# EAGLE board PCB3 (EAGLE 9.6.2)
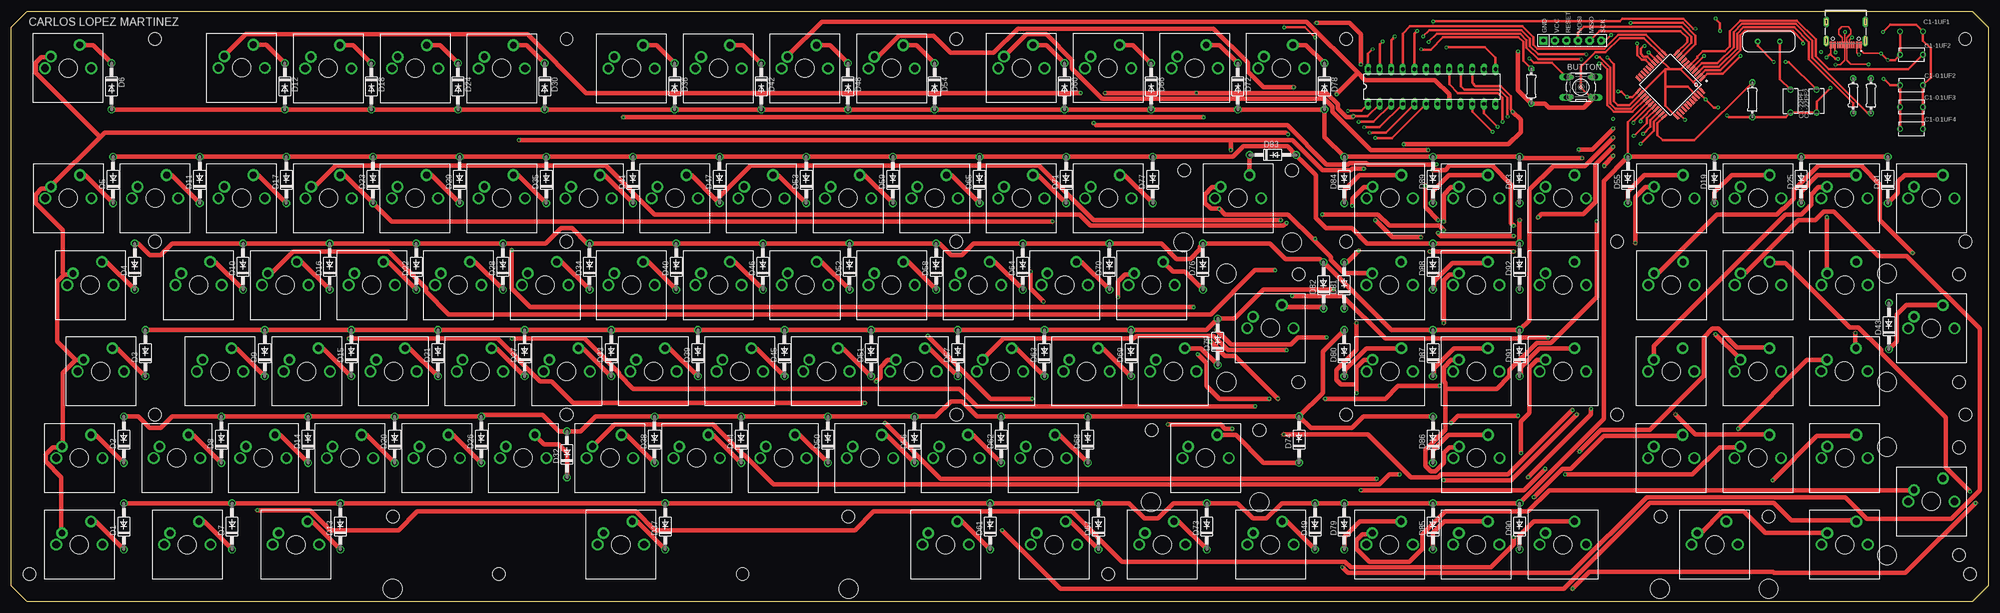
[diagram p2: board, top side]
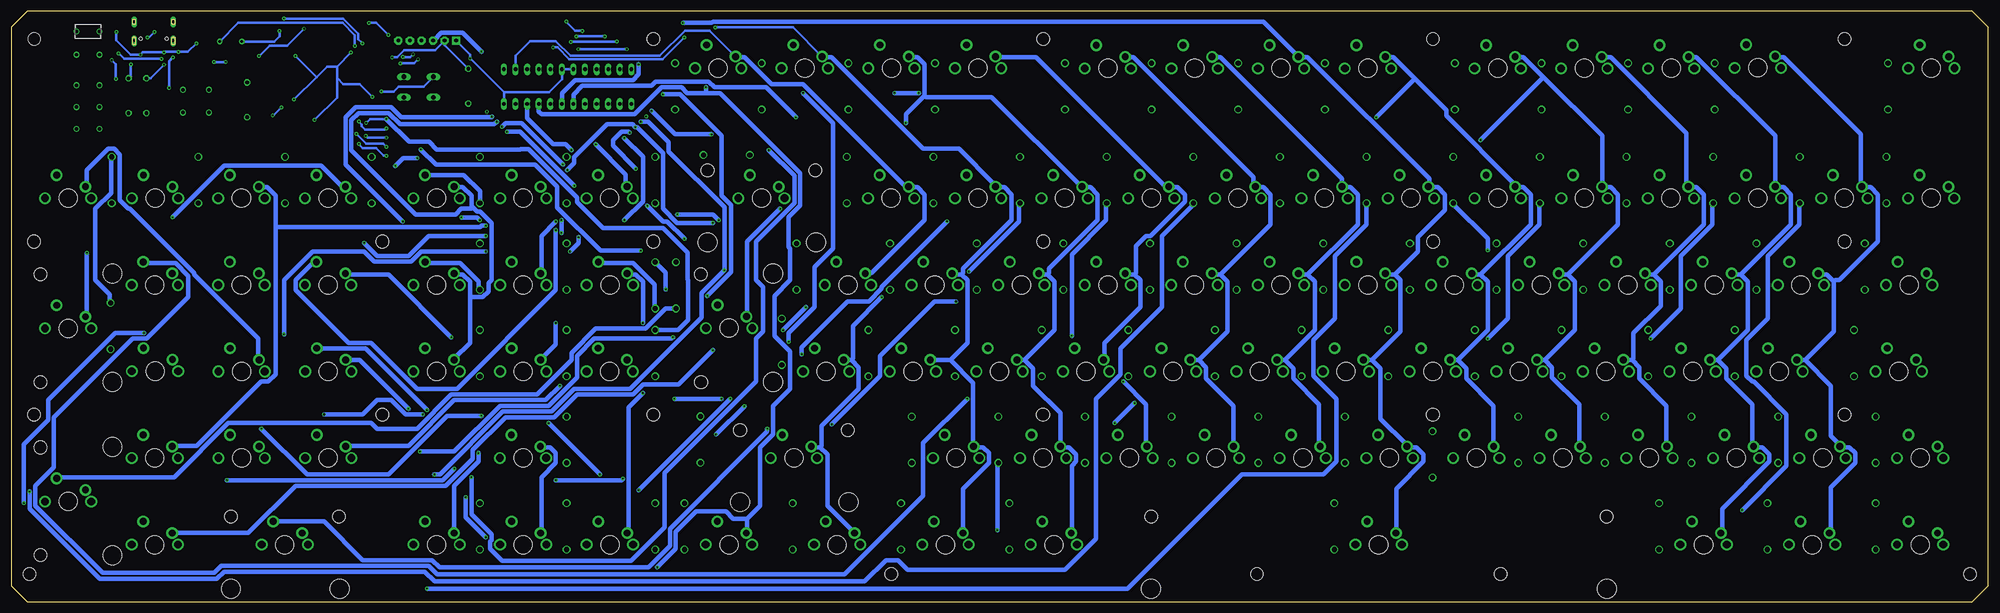
[diagram p3: board, bottom side, seen from below]

Size 433.5 x 129.5 mm. Coordinates in mm from the lower left corner, seen from the top.
Outline: 0,126 3.5,129.5 430,129.5 433.5,126 433.5,3.5 430,0 3.5,0 0,3.5 0,126
Copper layers (1*16): Top 0.035mm / dielectric 1.5mm / Bottom 0.035mm
Design rules "default *": minimum track width 0.5mm, minimum drill 0.35mm, track to track 10mil, track to pad 10mil, pad to pad 7mil, via to via 10mil, smd to smd 7mil, copper to edge 40mil, drill to drill 6mil, minimum pad ring 10mil, minimum via ring 8mil, stop-mask expansion 4mil, vias tented up to drill 0mil, thermal gap 10mil
Net classes: 0 default: width 0.203 mm
Holes 4.2 mm at 249.93,21.83 273.73,21.83 183.57,2.83 83.57,2.83 361.55,2.83 385.35,2.83 411.33,10.15 411.33,33.95 411.33,48.15 411.33,71.95 266.45,48.15 266.45,71.95 257.05,78.83 280.85,78.83
Holes 2.8 mm at 250.05,37.63 273.7,37.63 183.55,18.63 83.7,18.63 361.67,18.63 385.32,18.63 427.13,10.18 427.13,33.83 427.13,48.18 427.13,71.83 282.25,48.18 282.26,71.82 280.83,94.63 257.18,94.63 352.13,79 428.5,79 428.5,41 352.13,41 292.75,41 292.75,79 240.5,6.04 4,6.03 31.51,78.99 121.75,79 207.25,78.99 207.26,41 121.76,41 31.5,40.99 429.5,6.04
Holes 2.75 mm at 31.5,123.47 121.75,123.47 207.25,123.46 292.75,123.46 428.5,123.47 160.36,6.03 106.89,6.04

## Footprints (pad centres in the part's own frame; a part is rotated, then mirrored left to right if it is on the bottom)
B3F-10XX = drill 1.016 long: 1 -3.251,2.261; 2 3.251,2.261; 3 -3.251,-2.261; 4 3.251,-2.261
CAP_RDE5C1H273J2M1H03A = drill 0.75 pad 1.15: 1 -2.5,0; 2 2.5,0
DO41-10 = drill 1.118: A 5.08,0; C -5.08,0
CHERRY-MX = drill 1.714 pad 1.93: P$3 -5.08,0; P$4 5.08,0 | drill 1.5 pad 2.54: SW1 -3.81,2.54; SW2 2.54,5.08 | hole 4: 0,0
HRO_TYPE-C-31-M-12 = smd 0.6 x 1.45: A1B12 -3.25,5.095; A4B9 -2.45,5.095; B1A12 3.25,5.095; B4A9 2.45,5.095 | smd 0.3 x 1.45: A5 -1.25,5.095; A6 -0.25,5.095; A7 0.25,5.095; A8 1.25,5.095; B5 1.75,5.095; B6 0.75,5.095; B7 -0.75,5.095; B8 -1.75,5.095 | drill 0.65 pad 1.05 long: S1 -4.32,4.18; S2 4.32,4.18; S3 -4.32,0; S4 4.32,0 | hole 0.7: -2.89,3.65; 2.89,3.65
SIP-100-06-32 = drill 0.813 pad 1.778 square: 1 -6.35,0 | drill 0.813 pad 1.778 octagon: 2 -3.81,0; 3 -1.27,0; 4 1.27,0; 5 3.81,0; 6 6.35,0
DIL24-3 = drill 0.813 long: 1 -13.97,-3.81; 2 -11.43,-3.81; 3 -8.89,-3.81; 4 -6.35,-3.81; 5 -3.81,-3.81; 6 -1.27,-3.81; 7 1.27,-3.81; 8 3.81,-3.81; 9 6.35,-3.81; 10 8.89,-3.81; 11 11.43,-3.81; 12 13.97,-3.81; 13 13.97,3.81; 14 11.43,3.81; 15 8.89,3.81; 16 6.35,3.81; 17 3.81,3.81; 18 1.27,3.81; 19 -1.27,3.81; 20 -3.81,3.81; 21 -6.35,3.81; 22 -8.89,3.81; 23 -11.43,3.81; 24 -13.97,3.81
0204/7 = drill 0.813 octagon: 1 -3.81,0; 2 3.81,0
QFP80P1200X1200X120-44N = smd 1.5 x 0.5: 1 -5.9,4; 2 -5.9,3.2; 3 -5.9,2.4; 4 -5.9,1.6; 5 -5.9,0.8; 6 -5.9,0; 7 -5.9,-0.8; 8 -5.9,-1.6; 9 -5.9,-2.4; 10 -5.9,-3.2; 11 -5.9,-4; 23 5.9,-4; 24 5.9,-3.2; 25 5.9,-2.4; 26 5.9,-1.6; 27 5.9,-0.8; 28 5.9,0; 29 5.9,0.8; 30 5.9,1.6; 31 5.9,2.4; 32 5.9,3.2; 33 5.9,4 | smd 0.5 x 1.5: 12 -4,-5.9; 13 -3.2,-5.9; 14 -2.4,-5.9; 15 -1.6,-5.9; 16 -0.8,-5.9; 17 0,-5.9; 18 0.8,-5.9; 19 1.6,-5.9; 20 2.4,-5.9; 21 3.2,-5.9; 22 4,-5.9; 34 4,5.9; 35 3.2,5.9; 36 2.4,5.9; 37 1.6,5.9; 38 0.8,5.9; 39 0,5.9; 40 -0.8,5.9; 41 -1.6,5.9; 42 -2.4,5.9; 43 -3.2,5.9; 44 -4,5.9
XTAL_ECS-160-20-4X = drill 0.63 pad 1.03: 1 -2.44,0; 2 2.44,0

## Placement (x,y rotation side)
BUTTON  [B3F-10XX]  344.2,112.9 0 top
C1-0.1UF2  RDE5C1H273J2M1H03A  [CAP_RDE5C1H273J2M1H03A]  416.7,113.3 180 top
C1-0.1UF3  RDE5C1H273J2M1H03A  [CAP_RDE5C1H273J2M1H03A]  416.7,108.5 180 top
C1-0.1UF4  RDE5C1H273J2M1H03A  [CAP_RDE5C1H273J2M1H03A]  416.7,103.7 180 top
C1-1UF1  RDE5C1H273J2M1H03A  [CAP_RDE5C1H273J2M1H03A]  416.7,125.1 0 bottom
C1-1UF2  RDE5C1H273J2M1H03A  [CAP_RDE5C1H273J2M1H03A]  416.7,120 180 top
C1-22PF1  RDE5C1H273J2M1H03A  [CAP_RDE5C1H273J2M1H03A]  390.2,109.8 270 top
C1-22PF2  RDE5C1H273J2M1H03A  [CAP_RDE5C1H273J2M1H03A]  395.9,109.8 270 top
D1  1N4004  [DO41-10]  24.65,16.5 90 top
D2  1N4004  [DO41-10]  24.65,35.5 90 top
D3  1N4004  [DO41-10]  29.4,54.5 90 top
D4  1N4004  [DO41-10]  27.05,73.5 90 top
D5  1N4004  [DO41-10]  22.3,92.5 90 top
D6  1N4004  [DO41-10]  21.95,113.05 270 top
D7  1N4004  [DO41-10]  48.4,16.5 90 top
D8  1N4004  [DO41-10]  46.05,35.5 90 top
D9  1N4004  [DO41-10]  55.55,54.5 90 top
D10  1N4004  [DO41-10]  50.8,73.5 90 top
D11  1N4004  [DO41-10]  41.3,92.5 90 top
D12  1N4004  [DO41-10]  59.95,113.05 270 top
D13  1N4004  [DO41-10]  72.15,16.5 90 top
D14  1N4004  [DO41-10]  65.05,35.5 90 top
D15  1N4004  [DO41-10]  74.55,54.5 90 top
D16  1N4004  [DO41-10]  69.8,73.5 90 top
D17  1N4004  [DO41-10]  60.3,92.5 90 top
D18  1N4004  [DO41-10]  78.95,113.05 270 top
D19  1N4004  [DO41-10]  373.5,92.5 90 top
D20  1N4004  [DO41-10]  84.05,35.5 90 top
D21  1N4004  [DO41-10]  93.55,54.5 90 top
D22  1N4004  [DO41-10]  88.8,73.5 90 top
D23  1N4004  [DO41-10]  79.3,92.5 90 top
D24  1N4004  [DO41-10]  97.95,113.05 270 top
D25  1N4004  [DO41-10]  392.5,92.5 90 top
D26  1N4004  [DO41-10]  103.05,35.5 90 top
D27  1N4004  [DO41-10]  112.55,54.5 90 top
D28  1N4004  [DO41-10]  107.8,73.5 90 top
D29  1N4004  [DO41-10]  98.3,92.5 90 top
D30  1N4004  [DO41-10]  116.95,113.05 270 top
D31  1N4004  [DO41-10]  411.5,92.5 90 top
D32  1N4004  [DO41-10]  121.85,32.3 90 top
D33  1N4004  [DO41-10]  131.55,54.5 90 top
D34  1N4004  [DO41-10]  126.8,73.5 90 top
D35  1N4004  [DO41-10]  117.3,92.5 90 top
D36  1N4004  [DO41-10]  145.45,113.05 270 top
D37  1N4004  [DO41-10]  143.4,16.5 90 top
D38  1N4004  [DO41-10]  141.05,35.5 90 top
D39  1N4004  [DO41-10]  150.55,54.5 90 top
D40  1N4004  [DO41-10]  145.8,73.5 90 top
D41  1N4004  [DO41-10]  136.3,92.5 90 top
D42  1N4004  [DO41-10]  164.45,113.05 270 top
D43  1N4004  [DO41-10]  411.75,60.45 90 top
D44  1N4004  [DO41-10]  160.05,35.5 90 top
D45  1N4004  [DO41-10]  169.55,54.5 90 top
D46  1N4004  [DO41-10]  164.8,73.5 90 top
D47  1N4004  [DO41-10]  155.3,92.5 90 top
D48  1N4004  [DO41-10]  183.45,113.05 270 top
D49  1N4004  [DO41-10]  285.9,16.5 90 top
D50  1N4004  [DO41-10]  179.05,35.5 90 top
D51  1N4004  [DO41-10]  188.55,54.5 90 top
D52  1N4004  [DO41-10]  183.8,73.5 90 top
D53  1N4004  [DO41-10]  174.3,92.5 90 top
D54  1N4004  [DO41-10]  202.45,113.05 270 top
D55  1N4004  [DO41-10]  354.5,92.5 90 top
D56  1N4004  [DO41-10]  198.05,35.5 90 top
D57  1N4004  [DO41-10]  207.55,54.5 90 top
D58  1N4004  [DO41-10]  202.8,73.5 90 top
D59  1N4004  [DO41-10]  193.3,92.5 90 top
D60  1N4004  [DO41-10]  230.95,113.05 270 top
D61  1N4004  [DO41-10]  214.65,16.5 90 top
D62  1N4004  [DO41-10]  217.05,35.5 90 top
D63  1N4004  [DO41-10]  226.55,54.5 90 top
D64  1N4004  [DO41-10]  221.8,73.5 90 top
D65  1N4004  [DO41-10]  212.3,92.5 90 top
D66  1N4004  [DO41-10]  249.95,113.05 270 top
D67  1N4004  [DO41-10]  238.4,16.5 90 top
D68  1N4004  [DO41-10]  236.05,35.5 90 top
D69  1N4004  [DO41-10]  245.55,54.5 90 top
D70  1N4004  [DO41-10]  240.8,73.5 90 top
D71  1N4004  [DO41-10]  231.3,92.5 90 top
D72  1N4004  [DO41-10]  268.95,113.05 270 top
D73  1N4004  [DO41-10]  262.15,16.5 90 top
D74  1N4004  [DO41-10]  282.4,35.55 90 top
D75  1N4004  [DO41-10]  264.55,57 90 top
D76  1N4004  [DO41-10]  261.3,73.5 90 top
D77  1N4004  [DO41-10]  250.3,92.5 90 top
D78  1N4004  [DO41-10]  287.95,113.05 270 top
D79  1N4004  [DO41-10]  292.3,16.5 90 top
D80  1N4004  [DO41-10]  292.3,54.5 90 top
D81  1N4004  [DO41-10]  292.3,69.4 90 top
D82  1N4004  [DO41-10]  287.75,69.4 90 top
D83  1N4004  [DO41-10]  276.65,98 0 top
D84  1N4004  [DO41-10]  292.3,92.5 90 top
D85  1N4004  [DO41-10]  311.75,16.5 90 top
D86  1N4004  [DO41-10]  311.75,35.5 90 top
D87  1N4004  [DO41-10]  311.75,54.5 90 top
D88  1N4004  [DO41-10]  311.75,73.5 90 top
D89  1N4004  [DO41-10]  311.75,92.5 90 top
D90  1N4004  [DO41-10]  330.75,16.5 90 top
D91  1N4004  [DO41-10]  330.75,54.5 90 top
D92  1N4004  [DO41-10]  330.75,73.5 90 top
D93  1N4004  [DO41-10]  330.75,92.5 90 top
DUPLICADO1  CHERRY-MX  [CHERRY-MX]  364,31.5 0 top
DUPLICADO2  CHERRY-MX  [CHERRY-MX]  383,31.5 0 top
DUPLICADO3  CHERRY-MX  [CHERRY-MX]  402.05,31.5 0 top
DUPLICADO4  CHERRY-MX  [CHERRY-MX]  364,50.5 0 top
DUPLICADO5  CHERRY-MX  [CHERRY-MX]  383,50.5 0 top
DUPLICADO6  CHERRY-MX  [CHERRY-MX]  402,50.55 0 top
DUPLICADO7  CHERRY-MX  [CHERRY-MX]  364.05,69.45 0 top
DUPLICADO8  CHERRY-MX  [CHERRY-MX]  383.05,69.45 0 top
DUPLICADO9  CHERRY-MX  [CHERRY-MX]  402.05,69.45 0 top
DUPLICADO10  CHERRY-MX  [CHERRY-MX]  373.55,12.5 0 top
ENTERDUPLICADO  CHERRY-MX  [CHERRY-MX]  421.05,21.95 0 top
J2  TYPE-C-31-M-12  [HRO_TYPE-C-31-M-12]  402.3,127.2 180 top
J3  Boot  [SIP-100-06-32]  342.3,123.1 0 top
MULTIPLEXOR  74154N  [DIL24-3]  311.5,113 0 top
PUNTODUPLICADO  CHERRY-MX  [CHERRY-MX]  402.05,12.5 0 top
R1  22  [0204/7]  407.8,111 90 top
R2  22  [0204/7]  403.9,111 90 top
R4  1K  [0204/7]  381.8,110.1 90 top
R5  10K  [0204/7]  333.3,113.1 270 top
U1  ATMEGA32U4-AU  [QFP80P1200X1200X120-44N]  363.8,113.4 225 top
U$1  CHERRY-MX  [CHERRY-MX]  14.91,12.49 0 top
U$2  CHERRY-MX  [CHERRY-MX]  14.9,31.5 0 top
U$3  CHERRY-MX  [CHERRY-MX]  19.6,50.5 0 top
U$4  CHERRY-MX  [CHERRY-MX]  17.3,69.45 0 top
U$5  CHERRY-MX  [CHERRY-MX]  12.5,88.5 0 top
U$6  CHERRY-MX  [CHERRY-MX]  12.45,117.05 0 top
U$7  CHERRY-MX  [CHERRY-MX]  38.6,12.5 0 top
U$8  CHERRY-MX  [CHERRY-MX]  36.3,31.5 0 top
U$9  CHERRY-MX  [CHERRY-MX]  45.75,50.5 0 top
U$10  CHERRY-MX  [CHERRY-MX]  41.05,69.45 0 top
U$11  CHERRY-MX  [CHERRY-MX]  31.5,88.5 0 top
U$12  CHERRY-MX  [CHERRY-MX]  50.5,117.1 0 top
U$13  CHERRY-MX  [CHERRY-MX]  62.4,12.5 0 top
U$14  CHERRY-MX  [CHERRY-MX]  55.25,31.5 0 top
U$15  CHERRY-MX  [CHERRY-MX]  64.8,50.5 0 top
U$16  CHERRY-MX  [CHERRY-MX]  60.05,69.45 0 top
U$17  CHERRY-MX  [CHERRY-MX]  50.5,88.5 0 top
U$18  CHERRY-MX  [CHERRY-MX]  69.5,117 0 top
U$19  CHERRY-MX  [CHERRY-MX]  383.05,88.5 0 top
U$20  CHERRY-MX  [CHERRY-MX]  74.25,31.5 0 top
U$21  CHERRY-MX  [CHERRY-MX]  83.8,50.5 0 top
U$22  CHERRY-MX  [CHERRY-MX]  79.05,69.45 0 top
U$23  CHERRY-MX  [CHERRY-MX]  69.55,88.5 0 top
U$24  CHERRY-MX  [CHERRY-MX]  88.55,117 0 top
U$25  CHERRY-MX  [CHERRY-MX]  402,88.5 0 top
U$26  CHERRY-MX  [CHERRY-MX]  93.3,31.5 0 top
U$27  CHERRY-MX  [CHERRY-MX]  102.75,50.5 0 top
U$28  CHERRY-MX  [CHERRY-MX]  98,69.45 0 top
U$29  CHERRY-MX  [CHERRY-MX]  88.5,88.5 0 top
U$30  CHERRY-MX  [CHERRY-MX]  107.55,117 0 top
U$31  CHERRY-MX  [CHERRY-MX]  421.05,88.5 0 top
U$32  CHERRY-MX  [CHERRY-MX]  112.25,31.5 0 top
U$33  CHERRY-MX  [CHERRY-MX]  121.8,50.5 0 top
U$34  CHERRY-MX  [CHERRY-MX]  117.05,69.45 0 top
U$35  CHERRY-MX  [CHERRY-MX]  107.55,88.5 0 top
U$36  CHERRY-MX  [CHERRY-MX]  136,117 0 top
U$37  CHERRY-MX  [CHERRY-MX]  133.65,12.5 0 top
U$38  CHERRY-MX  [CHERRY-MX]  131.25,31.5 0 top
U$39  CHERRY-MX  [CHERRY-MX]  140.8,50.5 0 top
U$40  CHERRY-MX  [CHERRY-MX]  136,69.45 0 top
U$41  CHERRY-MX  [CHERRY-MX]  126.55,88.5 0 top
U$42  CHERRY-MX  [CHERRY-MX]  155.05,117 0 top
U$43  CHERRY-MX  [CHERRY-MX]  421.05,59.95 0 top
U$44  CHERRY-MX  [CHERRY-MX]  150.3,31.5 0 top
U$45  CHERRY-MX  [CHERRY-MX]  159.75,50.5 0 top
U$46  CHERRY-MX  [CHERRY-MX]  155.05,69.45 0 top
U$47  CHERRY-MX  [CHERRY-MX]  145.5,88.5 0 top
U$48  CHERRY-MX  [CHERRY-MX]  174,117 0 top
U$49  CHERRY-MX  [CHERRY-MX]  276.15,12.5 0 top
U$50  CHERRY-MX  [CHERRY-MX]  169.3,31.5 0 top
U$51  CHERRY-MX  [CHERRY-MX]  178.75,50.5 0 top
U$52  CHERRY-MX  [CHERRY-MX]  174.05,69.45 0 top
U$53  CHERRY-MX  [CHERRY-MX]  164.5,88.5 0 top
U$54  CHERRY-MX  [CHERRY-MX]  193.05,117 0 top
U$55  CHERRY-MX  [CHERRY-MX]  364.05,88.5 0 top
U$56  CHERRY-MX  [CHERRY-MX]  188.3,31.5 0 top
U$57  CHERRY-MX  [CHERRY-MX]  197.8,50.5 0 top
U$58  CHERRY-MX  [CHERRY-MX]  193.05,69.45 0 top
U$59  CHERRY-MX  [CHERRY-MX]  183.5,88.5 0 top
U$60  CHERRY-MX  [CHERRY-MX]  221.5,117.05 0 top
U$61  CHERRY-MX  [CHERRY-MX]  204.9,12.5 0 top
U$62  CHERRY-MX  [CHERRY-MX]  207.25,31.5 0 top
U$63  CHERRY-MX  [CHERRY-MX]  216.8,50.5 0 top
U$64  CHERRY-MX  [CHERRY-MX]  212,69.45 0 top
U$65  CHERRY-MX  [CHERRY-MX]  202.5,88.5 0 top
U$66  CHERRY-MX  [CHERRY-MX]  240.5,117.05 0 top
U$67  CHERRY-MX  [CHERRY-MX]  228.65,12.5 0 top
U$68  CHERRY-MX  [CHERRY-MX]  226.3,31.5 0 top
U$69  CHERRY-MX  [CHERRY-MX]  235.8,50.5 0 top
U$70  CHERRY-MX  [CHERRY-MX]  231,69.45 0 top
U$71  CHERRY-MX  [CHERRY-MX]  221.5,88.5 0 top
U$72  CHERRY-MX  [CHERRY-MX]  259.5,117.05 0 top
U$73  CHERRY-MX  [CHERRY-MX]  252.4,12.5 0 top
U$74  CHERRY-MX  [CHERRY-MX]  261.9,31.5 0 top
U$75  CHERRY-MX  [CHERRY-MX]  254.8,50.5 0 top
U$76  CHERRY-MX  [CHERRY-MX]  250.05,69.45 0 top
U$77  CHERRY-MX  [CHERRY-MX]  240.55,88.5 0 top
U$78  CHERRY-MX  [CHERRY-MX]  278.5,117.05 0 top
U$79  CHERRY-MX  [CHERRY-MX]  302.25,12.5 0 top
U$80  CHERRY-MX  [CHERRY-MX]  302.3,50.5 0 top
U$81  CHERRY-MX  [CHERRY-MX]  302.25,69.45 0 top
U$82  CHERRY-MX  [CHERRY-MX]  276.1,60 0 top
U$83  CHERRY-MX  [CHERRY-MX]  269,88.5 0 top
U$84  CHERRY-MX  [CHERRY-MX]  302.3,88.5 0 top
U$85  CHERRY-MX  [CHERRY-MX]  321.25,12.5 0 top
U$86  CHERRY-MX  [CHERRY-MX]  321.3,31.5 0 top
U$87  CHERRY-MX  [CHERRY-MX]  321.25,50.5 0 top
U$88  CHERRY-MX  [CHERRY-MX]  321.25,69.45 0 top
U$89  CHERRY-MX  [CHERRY-MX]  321.25,88.5 0 top
U$90  CHERRY-MX  [CHERRY-MX]  340.25,12.5 0 top
U$91  CHERRY-MX  [CHERRY-MX]  340.25,50.5 0 top
U$92  CHERRY-MX  [CHERRY-MX]  340.25,69.45 0 top
U$93  CHERRY-MX  [CHERRY-MX]  340.25,88.5 0 top
Y1  ECS-160-20-4X  [XTAL_ECS-160-20-4X]  385.4,122.9 180 top

## Tracks (layer width: path | path; a pad name or v marks a point on that pad's centre or on a via)
COD0  (via drill 0.35)
  Top 0.5: U1.26 358.43,110.36 355.52,107.45 351.39,107.45 349.95,108.89 349.95,116.79 348.63,118.1 v348.2,118.1 | v344.3,119 334.87,119 332.29,121.58 332.29,123.17 330.88,124.58 312.58,124.58 v310.8,122.8 | v300.7,122.9 300.07,122.27 MULTIPLEXOR.23
  Bottom 0.5: v348.2,118.1 345.2,118.1 v344.3,119 | v300.7,122.9 300.8,122.8 v310.8,122.8
COD1  (via drill 0.35)
  Top 0.5: U1.25 355.21,108.2 351.7,108.2 350.7,109.2 350.7,117.1 348.3,119.5 v347.6,119.5 | v345.4,120.1 334.83,120.1 333.05,121.89 333.05,123.49 331.19,125.35 310.95,125.35 v309.6,124 | v303.4,124 302.61,123.21 MULTIPLEXOR.22
  Bottom 0.5: v347.6,119.5 346,119.5 v345.4,120.1 | v309.6,124 v303.4,124
COD2
  Top 0.5: U1.12 362.39,120.4 358.39,124.4 352.4,124.4 349.3,121.3 334.7,121.3 333.8,122.2 333.8,123.8 331.4,126.2 306.7,126.2 305.15,124.65 MULTIPLEXOR.21
COD3  (via drill 0.35)
  Top 0.5: U1.1 371.89,115.84 375.34,115.84 v379.2,119.7 | v369.3,125.7 368.87,125.7 366.68,127.88 353.33,127.88 352.75,127.3 v311.8,127.3 | MULTIPLEXOR.20 307.69,124.59 v308.3,125.2
  Bottom 0.5: v379.2,119.7 376.9,122 373,122 v369.3,125.7 | v311.8,127.3 311.8,127.2 309.9,125.3 308.4,125.3 v308.3,125.2
D+
  Top 0.5: U1.4 370.76,118.1 374.17,118.1 377.7,121.63 377.7,124.93 379.51,126.75 391.29,126.75 394.95,123.09 394.95,119.35 407.11,107.19 R1.1
D-
  Top 0.5: U1.3 371.14,117.35 374.48,117.35 378.45,121.32 378.45,124.62 379.82,125.99 390.98,125.99 394.19,122.78 394.19,119.04 403.9,109.33 R2.1
DN  (via drill 0.35)
  Top 0.35: J2.B7 403.05,123.15 v403.7,123.8 | v402.1,125 402.05,124.95 J2.A7 402.05,118.75 401.1,117.8 v400,117.8
  Bottom 0.35: v403.7,123.8 403.3,123.8 v402.1,125
  Bottom 0.5: v400,117.8 402.99,114.81 R2.2
DP  (via drill 0.35)
  Top 0.35: J2.B6 401.55,123.75 400.8,124.5 400.8,125.5 401.4,126.1 402.8,126.1 403.4,125.5 403.4,124.6 402.55,123.75 J2.A6 402.55,118.75 403.4,117.9 v407.3,117.9
  Bottom 0.5: R1.2 407.3,115.31 v407.3,117.9
E0  (via drill 0.35)
  Top 0.5: U1.32 360.21,105.28 360.21,103.36 357.3,100.45 v357.3,100.4
  Top 1: D6.A D12.A D18.A D24.A D30.A 145.15,107.97 | 145.15,107.97 D36.A | v351.3,97.8 349.3,95.8 v349.3,95.6 | v344.5,97.3 331.03,97.3 D93.A D89.A D84.A 287.95,101.93 D78.A D72.A D66.A D60.A D54.A D48.A D42.A D36.A | 145.15,107.97 145.15,108.16 D36.A
  Bottom 0.5: v351.3,97.8 351.82,97.8 353.54,99.52 356.42,99.52 v357.3,100.4
  Bottom 1: v349.3,95.6 347.6,97.3 v344.5,97.3
E1  (via drill 0.35)
  Top 0.5: U1.31 359.45,105.66 359.45,104.19 357.87,102.6 v357.8,102.6
  Top 1: D5.A D11.A D17.A D23.A D29.A D35.A D41.A D47.A D53.A D59.A D65.A D71.A D77.A 267.88,97.58 270.2,99.9 279.83,99.9 D83.A 286.1,93.63 286.1,84.1 288.28,81.92 293.96,81.92 297.29,78.58 D88.A D92.A 330.75,83.65 v330.8,83.7 | v334.8,84.3 335.48,84.98 344.7,84.98 347.37,87.66 347.37,95.87 v351.3,99.8
  Bottom 0.5: v357.8,102.6 355.7,100.5 352,100.5 v351.3,99.8
  Bottom 1: v330.8,83.7 331.4,84.3 v334.8,84.3
E2  (via drill 0.35)
  Top 0.5: U1.30 358.7,106.04 358.7,105 355.9,102.2 v355.8,102.2
  Top 1: D4.A 27.8,78.58 30.3,76.07 32.72,76.07 35.22,78.58 D10.A D16.A D22.A D28.A 117.21,78.58 120.54,81.92 122.96,81.92 126.29,78.58 D34.A D40.A D46.A D52.A D58.A 203.54,78.58 206.04,76.07 208.46,76.07 210.96,78.58 D64.A D70.A 252.19,78.58 255.55,75.21 258.55,75.21 260.67,77.33 260.67,77.95 D76.A 275.99,78.58 279.35,75.21 287.02,75.21 D82.A 302.65,59.58 D87.A D91.A 332.9,61.73 332.9,90.36 338.14,95.6 345.1,95.6 v351.3,101.8
  Bottom 0.5: v355.8,102.2 355.4,101.8 v351.3,101.8
E3  (via drill 0.35)
  Top 0.5: U1.29 357.3,105.77 v357.3,105.4
  Top 1: v351.3,103.8 346.7,99.2 v343.7,99.2 | v295.5,77 292.98,74.48 D81.A | D3.A D9.A D15.A D21.A D27.A D33.A D39.A D45.A D51.A D57.A D63.A D69.A 262.05,59.58 D75.A 268.18,62.08 274.6,68.5 v290,68.5
  Bottom 0.5: v357.3,105.4 357.3,105.3 356.7,104.7 356.7,104.3 355.9,103.5 351.6,103.5 v351.3,103.8
  Bottom 1: v343.7,99.2 340.4,95.9 318.6,95.9 313.8,91.1 313.8,86.5 304.3,77 v295.5,77 | v290,68.5 290,72.18 D81.A
E4  (via drill 0.35)
  Top 0.5: U1.28 355.7,105.3 v355.7,105
  Top 1: D74.A 287.6,45.83 287.6,54.88 D80.A | D86.A 296.45,40.58 293.96,38.08 284.95,38.08 D74.A | D74.A 236.1,40.63 D68.A D62.A 211.8,40.58 208.47,43.92 206.05,43.92 202.72,40.58 D56.A D50.A D44.A D38.A 128.08,40.58 124.88,37.38 D32.A 120.12,37.38 116.5,41 103.47,41 D26.A D20.A D14.A D8.A 35.21,40.58 32.71,38.07 30.29,38.07 27.79,40.58 D2.A
  Bottom 0.5: v355.7,105 354.8,105.9 v351.3,105.9
  Bottom 1: v351.3,105.9 346.3,100.9 341.9,100.9 340.2,99.2 321.9,99.2 321.8,99.3 320.1,99.3 309.42,88.62 309.42,87.66 303.76,82 290.6,82 285.18,76.58 285.18,70.61 285.1,70.54 285.1,61.8 287.32,59.58 D80.A
E5
  Top 0.5: U1.27 354.5,105.23 D55.A
  Top 1: D31.A D25.A D19.A D55.A 349.2,92.28 349.2,40.03 D90.A D85.A D79.A D49.A 278.59,21.58 275.23,18.21 272.23,18.21 268.87,21.58 D73.A 254.79,21.58 251.43,18.21 248.43,18.21 245.07,21.58 D67.A D61.A D37.A D13.A D7.A D1.A
  Bottom 1: D43.A 411.94,65.83 411.94,67.4 415.07,70.54 415.07,86.21 411.62,89.66 411.62,97.5 D31.A
GND  (via drill 0.35)
  Top 0.35: 399.05,120.05 399.05,120.79 | J2.A1B12 405.55,120.95 406.2,120.3 v410,120.3 | v398.1,119.4 398.99,120.29 398.99,120.73 399.05,120.79 | 399.05,120.79 J2.B1A12
  Top 0.5: U1.23 355.44,110.7 v354.3,110.7 353.1,111.9 v352.4,111.9 | U1.15 360.76,118.74 v359,120.5 | U1.35 366.98,105.7 v367,105.7 | U1.43 371.5,110.22 v371.5,110.2 373.3,108.4 v374.3,108.4 | U1.5 371.2,119.67 v371.2,119.7 | v376.2,106.7 376.61,106.29 R4.1 389.19,106.29 C1-22PF1.2 C1-22PF2.2 395.9,109.7 v398.9,112.7 | BUTTON.1 337.86,118.25 333.86,118.25 v332.9,119.2 | v410.6,114.7 412,113.3 C1-0.1UF2.2 C1-0.1UF3.2 C1-0.1UF4.2 | C1-1UF1.2 C1-1UF2.2 413,118.8 v411.5,118.8 v410,120.3 | v400.6,119.1 400,119.1 399.05,120.05
  Bottom 0.5: v354.3,110.7 357.1,113.5 360.7,113.5 362.1,114.9 | 362.1,114.9 362.1,117.4 | 362.1,117.4 v359,120.5 | v367,105.7 362.1,110.6 362.1,114.9 | v371.5,110.2 366.6,115.1 | 366.6,115.1 364.3,117.4 362.1,117.4 | v371.2,119.7 366.6,115.1 | v374.3,108.4 376,106.7 v376.2,106.7 | v398.9,112.7 398.9,118.6 v398.1,119.4 | v352.4,111.9 349.7,111.9 348.6,113 343.11,113 BUTTON.1 | J3.1 332.9,120.05 v332.9,119.2 325.47,111.77 | MULTIPLEXOR.12 325.47,111.77 | MULTIPLEXOR.19 MULTIPLEXOR.18 312.77,114.63 315.63,111.77 325.47,111.77 | v411.5,118.8 410.6,117.9 v410.6,114.7 | v400.6,119.1 408.8,119.1 v410,120.3
MISO
  Top 0.5: U1.11 367.5,122.76 367.5,123.7 366,125.2 348.21,125.2 J3.5
MOSI
  Top 0.5: U1.10 365.71,119.9 368.45,122.64 368.45,123.91 366.27,126.1 344.8,126.1 343.57,124.87 J3.4
MUX0  (via drill 0.35)
  Top 0.5: MULTIPLEXOR.1 296.04,107.7 v293.1,107.7
  Top 1: 14.11,52.98 11.29,50.16 11.29,34.17 U$2.SW1 10.66,33.86 9.09,33.86 7.52,32.29 7.52,30.72 10.97,27.27 10.97,15.05 U$1.SW1 | 14.11,52.98 15.68,52.98 U$3.SW1 | 11.6,71.79 13.48,71.79 U$4.SW1 | 11.6,71.79 10.03,70.22 10.03,57.06 14.11,52.98 | v279.95,102.51 279.56,102.92 20.46,102.92 19.44,101.89 | 19.44,101.89 8.78,91.23 U$5.SW1 8.46,90.6 6.58,90.6 5.33,89.35 5.33,87.47 11.29,81.51 11.29,72.11 11.6,71.79 | 19.44,101.89 5.33,116 5.33,118.19 6.58,119.44 8.46,119.44 U$6.SW1
  Bottom 1: v293.1,107.7 287.91,102.51 v279.95,102.51
MUX1  (via drill 0.35)
  Top 0.5: MULTIPLEXOR.2 297.38,106.5 v294.3,106.5
  Top 1: v239.83,111.61 v259.89,111.61 288.43,111.61 290.93,109.11 290.93,108.16 292.81,106.28 294.06,106.28 v294.3,106.5 | v234.5,111.61 126.03,111.61 113.17,124.46 51.41,124.46 46.71,119.76 U$12.SW1 | v313.19,47.34 304.1,47.34 301.27,44.52 v288.11,44.52 | v277.76,44.52 268.36,53.92 266.16,53.92 v263.03,57.06
  Bottom 1: U$7.SW1 34.48,15.05 34.48,25.08 29.16,30.41 29.16,32.6 30.41,33.86 32.29,33.86 U$8.SW1 32.6,34.48 34.48,36.37 34.48,47.34 40.13,52.98 | 40.13,52.98 41.7,52.98 U$9.SW1 | 33.86,70.22 35.42,71.79 36.99,71.79 U$10.SW1 | 33.86,70.22 33.86,59.25 40.13,52.98 | 33.86,70.22 33.54,70.54 32.6,70.54 24.14,79 24.14,89.35 25.71,90.92 27.59,90.92 U$11.SW1 27.9,91.23 27.9,102.51 44.83,119.44 46.4,119.44 U$12.SW1 | v234.5,111.61 v239.83,111.61 | v313.19,47.34 316.32,44.2 336.38,44.2 346.42,34.17 359.9,34.17 DUPLICADO1.SW1 | v277.76,44.52 v288.11,44.52 | v263.03,57.06 263.03,58.94 257.38,64.58 257.38,73.36 253.31,77.43 253.31,105.02 v259.89,111.61
MUX2  (via drill 0.35)
  Top 0.5: MULTIPLEXOR.3 298.72,105.3 v295.5,105.3
  Top 1: v340.77,27.9 368.68,27.9 374.63,33.86 379.02,33.86 DUPLICADO2.SW1 | v277.13,72.73 272.75,72.73 263.04,63.03 95.93,63.03 90.92,68.04 90.92,68.66 82.76,76.81 61.76,76.81 57.06,72.11 56.43,72.11 U$16.SW1
  Bottom 1: 59.25,52.98 57.37,51.1 57.37,48.91 51.73,43.26 51.73,34.17 U$14.SW1 51.1,33.86 49.53,33.86 47.97,32.29 47.97,30.72 58.31,20.38 58.31,15.05 U$13.SW1 | 59.25,52.98 60.82,52.98 U$15.SW1 | 54.24,71.79 56.12,71.79 U$16.SW1 | 54.24,71.79 52.67,70.22 52.67,59.56 59.25,52.98 | 54.24,71.79 43.26,82.76 43.26,89.35 44.83,90.92 46.4,90.92 U$17.SW1 46.71,91.54 46.71,102.2 63.95,119.44 65.52,119.44 U$18.SW1 | v340.77,27.9 339.52,27.9 325.73,41.7 315.07,41.7 310.05,46.71 297.82,46.71 282.15,62.39 282.15,67.72 v277.13,72.73 277.13,86.53 289.36,98.75 289.36,98.96 289.4,99 289.4,100.8 293.9,105.3 v295.5,105.3
MUX3  (via drill 0.35)
  Top 0.5: MULTIPLEXOR.4 300.06,104.1 v296.7,104.1
  Top 1: v311.62,94.68 314.44,94.68 315.38,95.62 324.79,95.62 328.86,91.54 328.86,83.08 v329.49,82.45 | v279.64,83.08 279.01,82.45 236.69,82.45 234.19,84.96 141.07,84.96 130.42,95.62 71.17,95.62 66.78,91.23 65.83,91.23 U$23.SW1
  Bottom 1: 78.06,52.98 76.49,51.41 76.49,48.91 70.54,42.95 70.54,34.17 U$20.SW1 | 78.06,52.98 79.94,52.98 U$21.SW1 | 73.36,71.79 75.24,71.79 U$22.SW1 | 73.36,71.79 71.79,70.22 71.79,64.89 77.75,58.94 77.75,53.3 78.06,52.98 | 73.36,71.79 62.39,82.76 62.39,89.35 63.95,90.92 65.52,90.92 U$23.SW1 66.15,91.23 66.15,102.83 82.76,119.44 84.64,119.44 U$24.SW1 | 375.57,82.14 375.57,89.03 377.45,90.92 379.02,90.92 U$19.SW1 | 375.57,82.14 375.57,49.85 377.14,48.28 378.71,48.28 392.81,34.17 398.14,34.17 DUPLICADO3.SW1 | v311.62,94.68 310.05,96.25 310.05,97.5 302.84,104.71 297.31,104.71 v296.7,104.1 296.26,104.08 290.62,98.44 290.62,86.21 287.48,83.08 v279.64,83.08 | v329.49,82.45 330.43,82.45 330.74,82.14 375.57,82.14
MUX4  (via drill 0.35)
  Top 0.5: MULTIPLEXOR.5 301.4,102.9 v297.9,102.9
  Top 1: DUPLICADO4.SW1 360.21,53.3 360.21,56.12 389.05,84.96 392.5,84.96 394.7,87.15 394.7,89.35 396.26,90.92 398.14,90.92 U$25.SW1 | v296.57,94.99 294.06,94.99 293.75,94.68 287.48,94.68 280.9,101.26 267.42,101.26 | v111.29,101.26 267.42,101.26 | v346.42,42.32 346.42,41.07 v332.62,27.27 | 267.42,101.26 v267.42,99.07
  Bottom 1: 97.19,52.98 95.62,51.41 95.62,49.22 89.66,43.26 89.66,34.17 U$26.SW1 | 97.19,52.98 98.75,52.98 U$27.SW1 | 92.17,71.79 94.05,71.79 U$28.SW1 | 92.17,71.79 90.6,70.22 90.6,59.56 97.19,52.98 | 92.17,71.79 81.2,82.76 81.2,89.35 82.76,90.92 84.64,90.92 U$29.SW1 84.64,91.54 84.64,102.2 97.5,115.06 | 97.5,115.06 101.89,119.44 103.45,119.44 U$30.SW1 | v296.57,94.99 301.59,100.01 301.59,101.26 299.71,103.14 298.14,103.14 v297.9,102.9 | 97.5,115.06 v111.29,101.26 | v346.42,42.32 357.08,52.98 359.9,52.98 DUPLICADO4.SW1 | v332.62,27.27 332.62,19.12 328.24,14.73 328.24,13.48 328.55,13.17 328.55,11.6 325.93,8.98 297.62,8.98 290.3,16.3 290.3,28.21 270.24,48.28 270.24,57.68 268.67,59.25 268.67,68.97 270.24,70.54 270.24,79 261.77,87.47 261.77,93.42 v267.42,99.07
MUX5  (via drill 0.35)
  Top 0.5: MULTIPLEXOR.6 302.74,101.7 v299.1,101.7
  Top 1: v134.18,106.28 v261.46,106.28 | v373.69,58.62 379.02,53.3 DUPLICADO5.SW1 | v310.99,76.81 v329.49,76.81 | v309.11,79.94 302.84,79.94 v299.08,83.7
  Bottom 1: DUPLICADO5.SW1 379.33,53.3 379.33,57.68 393.44,71.79 393.44,72.11 407.55,86.21 407.86,86.21 409.75,88.09 409.75,98.13 411,99.38 412.25,99.38 416.95,94.68 416.95,91.23 U$31.SW1 | 116.31,52.98 114.43,51.1 114.43,48.91 108.47,42.95 108.47,34.17 U$32.SW1 | 116.31,52.98 117.88,52.98 U$33.SW1 | 111.29,71.79 113.17,71.79 U$34.SW1 | 111.29,71.79 109.72,70.22 109.72,59.56 116.31,52.98 | 111.29,71.79 100.32,82.76 100.32,89.35 101.89,90.92 103.45,90.92 U$35.SW1 103.77,91.54 118.82,106.59 118.82,107.84 125.71,114.74 | 125.71,114.74 130.42,119.44 131.98,119.44 U$36.SW1 | v261.46,106.28 268.04,112.86 279.33,112.86 280.58,114.11 292.18,114.11 293.12,113.17 308.33,113.17 310.23,111.27 MULTIPLEXOR.6 | 125.71,114.74 v134.18,106.28 | v373.69,58.62 373.69,70.54 367.42,76.81 356.14,76.81 353.94,74.61 345.79,74.61 343.6,76.81 v329.49,76.81 | v310.99,76.81 309.11,78.69 v309.11,79.94 | v299.08,83.7 295,87.78 295,97.6 v299.1,101.7
MUX6  (via drill 0.35)
  Top 1: v378.71,37.93 393.76,52.98 398.14,52.98 DUPLICADO6.SW1 | v330.43,40.76 317.26,40.76 v315.69,39.19 | v304.41,27.9 302.21,27.9 300.02,25.71 167.09,25.71 153.93,38.87 132.3,38.87 127.59,34.17 U$38.SW1 | v295.94,117.88 295.94,124.46 293.44,126.97 v286.23,126.97
  Bottom 1: U$37.SW1 129.79,15.05 129.79,24.77 123.83,30.72 123.83,32.29 125.4,33.86 127.28,33.86 U$38.SW1 127.59,34.48 133.24,40.13 133.24,51.1 135.12,52.98 | 135.12,52.98 136.69,52.98 U$39.SW1 | 130.1,71.79 131.98,71.79 U$40.SW1 | 130.1,71.79 128.85,70.54 128.85,59.25 135.12,52.98 | 130.1,71.79 125.09,76.81 125.09,79.94 119.13,85.9 119.13,89.35 120.7,90.92 122.58,90.92 U$41.SW1 122.58,91.54 122.58,92.8 149.23,119.44 151.11,119.44 U$42.SW1 151.42,119.76 158.94,127.28 279.64,127.28 279.95,126.97 v286.23,126.97 | v378.71,37.93 368.68,27.9 350.81,27.9 337.95,40.76 v330.43,40.76 | v304.41,27.9 v315.69,39.19 | v295.94,117.88 295.94,115.68 297.2,114.43 309.87,114.43 312.77,111.53 MULTIPLEXOR.7
MUX7  (via drill 0.35)
  Top 1: v416.95,76.49 409.75,83.7 409.75,91.54 405.67,95.62 396.26,95.62 390.94,90.29 390.94,88.41 388.74,86.21 388.43,86.21 387.17,84.96 374,84.96 361.15,72.11 360.52,72.11 DUPLICADO7.SW1 | 295.32,116 284.03,127.28 177.75,127.28 170.23,119.76 U$48.SW1 | 295.32,116 296.88,114.43 312.17,114.43 315.31,111.29 MULTIPLEXOR.8 | v337.01,58 331.37,58 331.06,57.68 301.27,57.68 291.87,67.09 v280.9,67.09 | 295.32,116 v290.63,111.31
  Bottom 1: v416.95,76.49 416.95,62.7 U$43.SW1 | 154.24,52.98 152.36,51.1 152.36,48.91 146.72,43.26 146.72,34.17 U$44.SW1 | 154.24,52.98 155.81,52.98 U$45.SW1 | 149.23,71.79 151.11,71.79 U$46.SW1 | 149.23,71.79 147.66,70.22 147.66,59.56 154.24,52.98 | 149.23,71.79 138.25,82.76 138.25,89.35 139.82,90.92 141.39,90.92 U$47.SW1 141.7,91.54 141.7,92.8 168.35,119.44 169.92,119.44 U$48.SW1 | v337.01,58 350.81,71.79 360.21,71.79 DUPLICADO7.SW1 | v280.9,67.09 275.68,72.31 275.68,86.95 277.76,89.03 277.76,102.2 286.87,111.31 v290.63,111.31
MUX8  (via drill 0.35)
  Top 1: v291.87,7.52 293.12,6.27 342.03,6.27 358.64,22.89 402.22,22.89 406.92,18.18 425.42,18.18 431.69,24.45 431.69,59.88 415.7,75.87 409.43,75.87 399.71,85.58 397.52,85.58 395.64,83.7 391.88,83.7 380.28,72.11 379.33,72.11 DUPLICADO8.SW1 | v281.21,112.86 274.63,112.86 271.18,116.31 271.18,118.19 263.65,125.71 220.7,125.71 215.38,120.38 205.97,120.38 202.21,124.15 194.68,124.15 190.29,119.76 189.35,119.76 U$54.SW1
  Bottom 1: 173.05,52.98 171.48,51.41 171.48,48.91 165.53,42.95 165.53,34.17 U$50.SW1 | 173.05,52.98 174.93,52.98 U$51.SW1 | 168.35,71.79 170.23,71.79 U$52.SW1 | 168.35,71.79 166.78,70.22 166.78,59.25 173.05,52.98 | 168.35,71.79 157.38,82.76 157.38,89.35 158.94,90.92 160.51,90.92 U$53.SW1 161.14,91.23 161.14,93.11 187.47,119.44 189.04,119.44 U$54.SW1 | 272.12,18.18 272.12,15.05 U$49.SW1 | 272.12,18.18 269.3,21 269.3,33.86 266.48,36.68 266.48,42.95 262.71,46.71 262.71,54.86 266.16,58.31 266.16,67.09 262.71,70.54 262.71,77.43 263.03,77.75 263.03,84.33 260.52,86.84 260.52,94.05 278.07,111.61 281.21,111.61 | 281.21,111.61 285.29,111.61 286.54,112.86 290.93,112.86 296.88,106.9 317.2,106.9 317.85,107.55 MULTIPLEXOR.9 | v291.87,7.52 287.79,11.6 287.79,15.31 283.36,19.75 276.82,19.75 275.25,18.18 272.12,18.18 | 281.21,111.61 v281.21,112.86
MUX9  (via drill 0.35)
  Top 0.5: MULTIPLEXOR.10 320.39,107.51 v324.8,103.1
  Top 1: v189.67,48.28 190.61,49.22 190.61,51.41 192.18,52.98 193.74,52.98 U$57.SW1 | v398.14,84.33 398.14,72.11 DUPLICADO9.SW1 | v310.68,99.07 298.14,99.07 289.67,107.53 289.67,108.58 287.91,110.35 239.2,110.35 232.62,116.94 232.62,118.82 226.97,124.46 222.59,124.46 217.88,119.76 U$60.SW1 | v356.14,78.69 356.14,88.72 358.33,90.92 360.21,90.92 U$55.SW1 | v329.49,80.26 313.5,80.26 v312.87,80.88 | v312.87,83.7 310.05,86.53 v310.05,91.23
  Bottom 1: v189.67,48.28 184.65,43.26 184.65,34.17 U$56.SW1 | 187.16,71.79 189.04,71.79 U$58.SW1 | 187.16,71.79 185.91,70.54 185.91,64.58 193.74,56.74 193.74,53.3 U$57.SW1 | 187.16,71.79 186.85,72.11 186.85,78.06 184.65,80.26 183.71,80.26 176.19,87.78 176.19,89.35 177.75,90.92 179.64,90.92 U$59.SW1 179.95,91.23 180.58,91.23 208.79,119.44 217.57,119.44 U$60.SW1 | v398.14,84.33 386.86,95.62 365.54,95.62 361.15,91.23 360.52,91.23 U$55.SW1 | v356.14,78.69 353.31,75.87 346.42,75.87 342.03,80.26 v329.49,80.26 | v312.87,83.7 v312.87,80.88 | v310.05,91.23 321.96,103.14 324.79,103.14 v324.8,103.1 | MULTIPLEXOR.10 320.39,106.09 314.7,100.4 312.01,100.4 v310.68,99.07
MUX10  (via drill 0.35)
  Top 0.5: MULTIPLEXOR.11 322.93,107.17 v325.9,104.2
  Top 1: v312.56,95.93 297.51,95.93 297.2,96.25 293.44,96.25 293.12,95.93 288.42,95.93 279.83,104.52 237.82,104.52 v237.32,105.02 | DUPLICADO10.SW1 369.93,15.05 370.56,15.05 375.26,19.75 379.96,19.75 384.66,15.05 398.14,15.05 PUNTODUPLICADO.SW1 | v279.64,55.18 266.79,55.18 263.65,58.31 246.72,58.31 246.1,57.68 217.57,57.68 213.18,53.3 U$63.SW1
  Bottom 1: v237.32,105.02 237.32,106.9 233.24,110.98 | 233.24,110.98 233.24,117.88 234.81,119.44 236.38,119.44 U$66.SW1 | U$61.SW1 200.95,15.05 200.95,29.78 200.01,30.72 200.01,32.29 201.58,33.86 203.15,33.86 U$62.SW1 203.46,34.48 203.46,41.38 209.42,47.34 209.42,51.1 211.3,52.98 | 211.3,52.98 212.87,52.98 U$63.SW1 | 206.28,71.79 208.16,71.79 U$64.SW1 | 206.28,71.79 204.72,70.22 204.72,59.56 211.3,52.98 | 206.28,71.79 205.97,72.11 205.97,73.05 195.31,83.7 195.31,89.35 196.88,90.92 198.45,90.92 U$65.SW1 199.07,91.23 218.51,110.67 232.93,110.67 233.24,110.98 | v279.64,55.18 287.17,47.65 295,47.65 297.2,45.46 309.43,45.46 314.44,40.44 325.1,40.44 332.31,33.23 332.31,31.35 338.27,25.39 371.18,25.39 381.53,15.05 398.14,15.05 PUNTODUPLICADO.SW1 | v325.9,104.2 325.1,105 321.63,105 v312.56,95.93
MUX11  (via drill 0.35)
  Top 0.5: MULTIPLEXOR.13 325.47,119.31 323.18,121.6 v314.7,121.6 | v285.9,123.8 283.7,126 v279.1,126
  Bottom 0.5: v314.7,121.6 313.77,121.6 311.21,119.05 290.65,119.05 v285.9,123.8 | v279.1,126 262.1,126 U$72.SW1
  Bottom 1: U$67.SW1 224.78,15.05 224.78,24.77 219.14,30.41 219.14,32.6 220.39,33.86 222.27,33.86 U$68.SW1 222.59,34.48 222.59,47.97 227.6,52.98 | 227.6,52.98 231.99,52.98 U$69.SW1 | 225.09,71.79 226.97,71.79 U$70.SW1 | 225.09,71.79 223.84,70.54 223.84,56.74 227.6,52.98 | 225.09,71.79 224.78,72.11 224.78,73.05 214.12,83.7 214.12,89.35 215.69,90.92 217.57,90.92 U$71.SW1 217.88,91.54 225.72,99.38 233.56,99.38 253.62,119.44 255.5,119.44 U$72.SW1
MUX12  (via drill 0.35)
  Top 1: v242.65,66.78 242.65,70.22 244.22,71.79 246.1,71.79 U$76.SW1
  Bottom 0.5: U$78.SW1 280.4,125.3 285.8,125.3 291.3,119.8 310.9,119.8 314.1,123 319.7,123 322.93,119.77 MULTIPLEXOR.14
  Bottom 1: 256.13,33.86 254.56,32.29 254.56,21 248.61,15.05 U$73.SW1 | 256.13,33.86 258.01,33.86 U$74.SW1 | 249.23,52.98 250.8,52.98 U$75.SW1 | 249.23,52.98 247.66,51.41 247.66,46.71 255.82,38.56 255.82,34.17 256.13,33.86 | U$76.SW1 246.1,72.11 244.84,72.11 233.24,83.7 233.24,89.35 234.81,90.92 236.69,90.92 U$77.SW1 237.01,91.23 237.63,91.23 259.89,113.49 266.79,113.49 272.75,119.44 274.63,119.44 U$78.SW1 | v242.65,66.78 248.92,60.51 248.92,53.3 249.23,52.98
MUX13  (via drill 0.35)
  Top 0.5: MULTIPLEXOR.15 320.39,113.82 321.1,113.11 326.62,113.11 328.81,110.92 328.81,107.89 v329.2,107.5
  Top 1: v305.35,100.32 328.35,100.32 330.99,102.96 330.99,105.71 v329.2,107.5 | U$83.SW1 264.91,90.92 263.34,90.92 261.77,89.35 261.77,87.47 263.03,86.21 v264.91,86.21 266.16,84.96 279.95,84.96 285.6,79.32 | 285.6,79.32 289.36,75.55 289.36,74.93 292.18,72.11 298.14,72.11 U$81.SW1 | v294.06,86.84 294.06,88.41 296.57,90.92 298.45,90.92 U$84.SW1 | v285.91,79.63 285.6,79.32 | 295,47.65 295,51.41 296.57,52.98 298.45,52.98 U$80.SW1 | 295,47.65 v295,45.77 | ENTERDUPLICADO.SW1 416.95,24.45 337.33,24.45 332.62,19.75 314.44,19.75 309.43,14.73 309.43,11.6 306.6,8.78 297.82,8.78 295,11.6 295,13.48 296.26,14.73 298.14,14.73 U$79.SW1 | v295,61.13 295,55.18 290.62,50.79 290.62,48.59 291.56,47.65 295,47.65
  Bottom 1: v305.35,100.32 298.76,93.74 298.76,91.23 U$84.SW1 | v264.91,86.21 272.12,79 272.12,62.7 U$82.SW1 | v294.06,86.84 290.62,83.39 289.67,83.39 v285.91,79.63 | v295,45.77 298.14,42.64 298.14,15.05 U$79.SW1 | v295,61.13 295,70.22 296.57,71.79 298.14,71.79 U$81.SW1
MUX14  (via drill 0.35)
  Top 0.5: MULTIPLEXOR.16 317.85,113.1 318.6,112.35 326.31,112.35 328.05,110.61 328.05,106.45 v328.1,106.4
  Top 1: 314.44,46.71 314.44,37.62 310.05,33.23 310.05,29.78 311.31,28.53 312.25,28.53 314.13,30.41 314.13,32.6 315.38,33.86 317.26,33.86 U$86.SW1 | 314.44,46.71 314.44,47.97 314.13,48.28 314.13,51.41 315.69,52.98 317.26,52.98 U$87.SW1 | v314.13,61.13 314.13,70.54 315.38,71.79 317.26,71.79 U$88.SW1 | v314.13,83.39 314.13,89.35 315.69,90.92 317.26,90.92 U$89.SW1 | v347.67,83.39 347.67,66.78 337.64,56.74 334.5,56.74 328.55,50.79 328.55,49.53 325.73,46.71 314.44,46.71
  Bottom 1: U$85.SW1 317.26,15.05 317.26,27.27 314.13,30.41 314.13,32.6 315.38,33.86 317.26,33.86 U$86.SW1 | v314.13,61.13 314.13,56.43 317.26,53.3 U$87.SW1 | v314.13,83.39 317.26,80.26 317.26,72.11 U$88.SW1 | v347.67,83.39 360.21,95.93 360.21,106.28 358.02,108.47 350.18,108.47 347.99,106.28 328.24,106.28 v328.1,106.4
MUX15  (via drill 0.35)
  Top 0.5: MULTIPLEXOR.17 315.31,113.49 317.2,111.6 326,111.6 327,110.6 v327,105.3
  Top 1: v331.06,32.6 331.06,39.5 332.94,41.38 332.94,51.41 334.5,52.98 336.38,52.98 U$91.SW1
  Bottom 1: v331.06,32.6 331.06,30.72 336.38,25.39 336.38,15.05 U$90.SW1 | 332.94,66.78 332.94,56.74 336.38,53.3 U$91.SW1 | 332.94,66.78 332.94,70.22 334.5,71.79 336.38,71.79 U$92.SW1 | 332.31,86.53 331.37,85.58 330.74,85.58 328.24,83.08 328.24,70.54 328.86,69.91 328.86,68.03 330.12,66.78 332.94,66.78 | 332.31,86.53 332.62,86.84 332.62,89.03 334.5,90.92 336.38,90.92 U$93.SW1 | 332.31,86.53 332.62,86.21 334.82,86.21 336.07,84.96 344.85,84.96 358.96,99.07 358.96,105.65 357.39,107.22 350.81,107.22 348.3,104.71 327.59,104.71 v327,105.3
N$1
  Top 1: D4.C 20.94,74.53 U$4.SW2
N$2
  Top 1: D10.C 44.69,74.53 U$10.SW2
N$3
  Top 1: D16.C 63.69,74.53 U$16.SW2
N$4
  Top 1: D22.C 82.69,74.53 U$22.SW2
N$5
  Top 1: D5.C 16.14,93.58 U$5.SW2
N$6
  Top 1: D6.C 17.95,122.13 U$6.SW2
N$7
  Top 1: D28.C 101.69,74.53 U$28.SW2
N$8
  Top 1: D34.C 120.69,74.53 U$34.SW2
N$9
  Top 1: D40.C 139.69,74.53 U$40.SW2
N$10
  Top 1: D46.C 158.69,74.53 U$46.SW2
N$11  (via drill 0.35)
  Top 1: D11.C 35.14,93.58 U$11.SW2 | v333.88,22.89 340.15,29.16 342.03,29.16 349.24,36.37 366.48,36.37 DUPLICADO1.SW2 | v329.49,14.11 329.49,12.54 324.47,7.52 293.75,7.52 292.5,8.78 243.59,8.78 232.62,19.75 189.04,19.75 184.97,15.68 141.07,15.68 137,19.75 89.03,19.75 84.96,15.68 69.91,15.68 65.52,20.06 v53.92,20.06
  Bottom 1: v333.88,22.89 333.88,18.5 v329.49,14.11 | v53.92,20.06 44.2,29.78 44.2,41.07 51.41,48.28 51.73,48.28 52.98,49.53 52.98,57.37 48.28,62.07 48.28,75.87 41.38,82.76 41.38,87.15 D11.C
N$12
  Top 1: D12.C 55.9,122.18 U$12.SW2
N$13
  Top 1: D52.C 177.69,74.53 U$52.SW2
N$14
  Top 1: D58.C 196.69,74.53 U$58.SW2
N$15
  Top 1: D64.C 215.69,74.53 U$64.SW2
N$16
  Top 1: D70.C 234.69,74.53 U$70.SW2
N$17  (via drill 0.35)
  Top 1: D17.C 54.14,93.58 U$17.SW2 | v364.91,41.07 369.3,36.68 385.29,36.68 DUPLICADO2.SW2 | v343.28,41.07 328.86,26.65 v314.13,26.65 | v299.39,26.96 203.78,26.96 v191.55,39.19 | v187.16,43.58 123.21,43.58 118.5,48.28 116,48.28 106.59,57.68 v73.99,57.68
  Bottom 1: v364.91,41.07 356.45,41.07 353.31,44.2 350.18,44.2 347.05,41.07 v343.28,41.07 | v314.13,26.65 299.71,26.65 v299.39,26.96 | v187.16,43.58 v191.55,39.19 | v73.99,57.68 67.4,64.27 67.4,75.87 60.51,82.76 60.51,87.15 D17.C
N$18
  Top 1: D18.C 75,122.08 U$18.SW2
N$19
  Top 1: D76.C 257.32,72.4 254.72,72.4 U$76.SW2
N$20
  Top 1: D87.C 311.93,49.53 311.93,51.1 316.32,55.49 323.53,55.49 U$87.SW2
N$21
  Top 1: D91.C 331.06,49.53 331.06,51.41 335.13,55.49 342.66,55.49 U$91.SW2
N$22
  Bottom 1: D81.C 292.5,64.58 292.5,69.6 297.2,74.3 304.72,74.3 U$81.SW2
N$23  (via drill 0.35)
  Top 1: U$23.SW2 73.14,93.58 D23.C 79.63,87.15 83.38,83.4 v228.31,83.4 | v386.23,26.65 395.95,36.37 404.42,36.37 DUPLICADO3.SW2 | v336.38,29.16 331.68,24.45 v295.94,24.45 | v275.88,44.52 264.91,44.52 262.09,47.34 262.09,52.35 v260.2,54.24
  Bottom 1: v386.23,26.65 338.89,26.65 v336.38,29.16 | v275.88,44.52 v295.94,24.45 | v260.2,54.24 260.2,55.8 250.17,65.83 245.47,65.83 242.65,68.66 242.65,69.07 v228.31,83.4
N$24
  Top 1: D24.C 94,122.08 U$24.SW2
N$25
  Top 1: U$75.SW2 260.89,55.58 D75.C
N$26
  Top 1: U$69.SW2 239.39,55.58 D69.C
N$27
  Top 1: D63.C 220.39,55.58 U$63.SW2
N$28
  Top 1: D57.C 201.39,55.58 U$57.SW2
N$29  (via drill 0.35)
  Top 1: D29.C 92.14,93.58 U$29.SW2 | v342.34,42.01 328.24,27.9 313.5,27.9 312.87,27.27 306.92,27.27 297.51,36.68 v279.01,36.68 | v272.73,42.86 211.79,42.86 207.94,46.71 136.37,46.71 133.24,49.85 133.24,50.16 125.71,57.68 v109.72,57.68
  Bottom 1: v342.34,42.01 355.82,55.49 366.48,55.49 DUPLICADO4.SW2 | v279.01,36.68 278.92,36.68 v272.73,42.86 | v109.72,57.68 105.34,62.07 105.34,75.87 98.44,82.76 98.44,87.15 D29.C
N$30
  Top 1: D30.C 113,122.08 U$30.SW2
N$37
  Top 1: D51.C 182.39,55.58 U$51.SW2
N$38
  Top 1: D45.C 163.39,55.58 U$45.SW2
N$39
  Top 1: D39.C 144.39,55.58 U$39.SW2
N$40
  Top 1: D33.C 125.39,55.58 U$33.SW2
N$41  (via drill 0.35)
  Top 1: D35.C 111.14,93.58 U$35.SW2 | v343.91,32.92 348.61,37.62 359.27,37.62 371.18,49.53 371.18,58 373.06,59.88 374.32,59.88 378.39,55.8 385.29,55.8 DUPLICADO5.SW2 | v288.42,58 282.15,58 280.58,56.43 267.42,56.43 v264.28,59.56 | v259.26,64.58 113.8,64.58 109.72,68.66 v109.72,77.12
  Bottom 1: v343.91,32.92 336.38,32.92 326.35,42.95 315.69,42.95 309.43,49.22 309.43,53.92 305.66,57.68 288.73,57.68 v288.42,58 | v259.26,64.58 v264.28,59.56 | v109.72,77.12 109.72,79.63 117.25,87.15 D35.C
N$42
  Top 1: D36.C 141.5,122.08 U$36.SW2
N$43
  Top 1: D27.C 106.39,55.58 U$27.SW2
N$44
  Top 1: D21.C 87.39,55.58 U$21.SW2
N$45
  Top 1: D15.C 68.39,55.58 U$15.SW2
N$46
  Top 1: D9.C 49.39,55.58 U$9.SW2
N$47  (via drill 0.35)
  Top 1: D41.C 130.14,93.58 U$41.SW2 | v404.42,58.94 404.42,55.8 DUPLICADO6.SW2 | v430.75,21.63 415.39,6.27 386.55,6.27 386.23,6.58 346.1,6.58 v342.34,2.82
  Bottom 1: v404.42,58.94 410.69,58.94 425.42,44.2 425.42,39.81 430.75,34.48 v430.75,21.63 | v342.34,2.82 188.73,2.82 163.65,27.9 145.78,27.9 142.96,30.72 142.96,44.52 147.97,49.53 147.97,57.37 143.27,62.07 143.27,75.87 136.37,82.76 136.37,87.15 D41.C
N$48
  Top 1: D42.C 160.5,122.08 U$42.SW2
N$49
  Top 1: D3.C 23.24,55.58 U$3.SW2
N$50
  Top 1: D2.C 18.49,36.58 U$2.SW2
N$51
  Top 1: U$8.SW2 39.89,36.58 D8.C
N$52
  Top 1: U$14.SW2 58.89,36.58 D14.C
N$53  (via drill 0.35)
  Top 1: D47.C 154.59,88.13 | 154.59,88.13 149.14,93.58 U$47.SW2 | v314.13,81.51 313.19,82.45 302.21,82.45 299.71,84.96 v287.48,84.96 | v278.39,83.7 237.32,83.7 225.41,95.62 162.08,95.62 154.59,88.13
  Bottom 1: v314.13,81.51 314.13,68.34 335.76,46.71 344.54,46.71 354.57,56.74 359.58,56.74 371.18,68.34 371.18,70.54 367.42,74.3 366.8,74.3 DUPLICADO7.SW2 | v287.48,84.96 279.64,84.96 v278.39,83.7
N$54
  Top 1: D48.C 179.5,122.08 U$48.SW2
N$55
  Top 1: U$20.SW2 77.89,36.58 D20.C
N$56
  Top 1: U$26.SW2 96.89,36.58 D26.C
N$57
  Top 1: U$32.SW2 116.87,34.5 120,34.5 121.85,32.65 D32.C
N$58
  Top 1: U$38.SW2 134.89,36.58 D38.C
N$59  (via drill 0.35)
  Top 1: D53.C 168.14,93.58 U$53.SW2 | v429.5,24.14 424.17,29.47 424.17,40.44 410.06,54.55 410.06,55.18 405.04,60.19 403.16,60.19 389.05,74.3 385.61,74.3 DUPLICADO8.SW2
  Bottom 1: v429.5,24.14 429.5,20.38 414.13,5.02 388.43,5.02 386.86,6.58 342.86,6.58 340.69,4.42 246.38,4.42 241.71,9.09 239.09,9.09 237,7 202.42,7 195.62,13.79 195.62,44.52 190.29,49.85 190.29,55.49 181.2,64.58 181.2,80.26 174.31,87.15 D53.C
N$60
  Top 1: D54.C 198.5,122.08 U$54.SW2
N$61
  Top 1: D44.C 153.89,36.58 U$44.SW2
N$62
  Top 1: D50.C 172.89,36.58 U$50.SW2
N$63
  Top 1: D56.C 191.89,36.58 U$56.SW2
N$64
  Top 1: D68.C 229.89,36.58 U$68.SW2
N$65  (via drill 0.35)
  Top 1: D59.C 187.14,93.58 U$59.SW2 | v223.84,44.52 214.75,44.52 v200.95,58.31
  Bottom 1: v223.84,44.52 233.56,34.8 233.56,23.2 250.79,5.97 340.16,5.97 342.03,7.84 387.49,7.84 389.05,6.27 413.51,6.27 428.24,21 428.24,25.39 424.17,29.47 424.17,40.44 406.92,57.68 403.79,57.68 394.7,66.78 394.7,71.48 397.52,74.3 404.42,74.3 DUPLICADO9.SW2 | v200.95,58.31 200.95,76.18 193.43,83.7 193.43,87.15 D59.C
N$66
  Top 1: U$60.SW2 226.95,122.13 D60.C
N$67
  Top 1: D74.C 274.63,30.47 268.52,36.58 U$74.SW2
N$68  (via drill 0.35)
  Top 1: D62.C 210.89,36.58 U$62.SW2 | v217.26,15.68 230.11,2.82 340.46,2.82 359.27,21.63 386.55,21.63 390.31,17.87 404.42,17.87 PUNTODUPLICADO.SW2
  Bottom 1: v217.26,15.68 217.26,30.41 D62.C
N$69
  Top 1: D80.C 292.5,49.53 292.5,50.79 297.2,55.49 304.72,55.49 U$80.SW2
N$70
  Top 1: U$86.SW2 315.18,36.58 311.75,33.15 D86.C
N$71  (via drill 0.35)
  Top 1: D65.C 206.14,93.58 U$65.SW2 | v267.73,37.93 266.16,37.93 265.22,38.87 v253.62,38.87 | v226.35,65.83 223.53,68.66 v223.53,72.42
  Bottom 1: v267.73,37.93 267.73,37.31 289.05,15.99 289.05,12.23 293.75,7.52 339.63,7.52 341.2,9.09 356.45,9.09 364.91,17.56 375.89,17.56 DUPLICADO10.SW2 | v253.62,38.87 242.96,49.53 242.96,53.92 231.05,65.83 v226.35,65.83 | v223.53,72.42 212.55,83.39 212.55,87.15 D65.C
N$72
  Top 1: U$66.SW2 245.95,122.13 D66.C
N$73
  Top 1: D90.C 330.75,14.45 333.88,17.58 U$90.SW2
N$74
  Top 1: D85.C 311.75,15.05 314.28,17.58 U$85.SW2
N$75
  Top 1: D79.C 292.3,14.2 295.68,17.58 U$79.SW2
N$76
  Top 1: D73.C 255.99,17.58 U$73.SW2
N$77
  Top 1: D71.C 225.14,93.58 U$71.SW2
N$78
  Top 1: U$72.SW2 264.95,122.13 D72.C
N$79
  Top 1: D67.C 232.24,17.58 U$67.SW2
N$80
  Top 1: D61.C 208.49,17.58 U$61.SW2
N$81
  Top 1: D55.C 354.5,90 358.08,93.58 U$55.SW2
N$82
  Top 1: D49.C 279.74,17.58 U$49.SW2
N$83
  Top 1: U$77.SW2 244.14,93.58 D77.C
N$84
  Top 1: U$78.SW2 283.95,122.13 D78.C
N$85
  Top 1: D43.C 413.5,57.12 413.5,63 415.53,65.03 U$43.SW2
N$86
  Top 1: D37.C 137.24,17.58 U$37.SW2
N$87
  Top 1: D31.C 413.7,89.62 413.7,92.1 415.18,93.58 U$31.SW2
N$88
  Top 1: D82.C 287.48,64.58 279.01,64.58 278.7,64.89 U$82.SW2
  Bottom 1: ENTERDUPLICADO.SW2 423.54,27.27 397.83,27.27 385.92,39.19 354.57,39.19 353.31,37.93 344.54,37.93 337.01,45.46 318.2,45.46 310.68,52.98 310.68,54.55 305.35,59.88 294.38,59.88 289.99,64.27 287.79,64.27 D82.C
N$89
  Top 1: U$83.SW2 271.54,97.97 D83.C
N$90
  Top 1: D84.C 292.3,90.3 295.58,93.58 U$84.SW2
N$91
  Top 1: D25.C 392.5,90 396.08,93.58 U$25.SW2
N$92
  Top 1: D19.C 373.5,89.8 377.28,93.58 U$19.SW2
N$93
  Top 1: D13.C 65.99,17.58 U$13.SW2
N$94
  Top 1: D88.C 311.93,68.66 311.93,70.22 316.01,74.3 323.53,74.3 U$88.SW2
N$95
  Top 1: D89.C 311.75,90.05 315.28,93.58 U$89.SW2
N$96
  Top 1: D7.C 42.24,17.58 U$7.SW2
N$97
  Top 1: D1.C 18.5,17.57 U$1.SW2
N$98
  Bottom 1: D92.C 331.06,68.66 331.06,70.22 335.13,74.3 342.66,74.3 U$92.SW2
N$99
  Bottom 1: D93.C 330.75,90.05 334.28,93.58 U$93.SW2
PE2
  Top 0.5: U1.33 361,104.94 361,102.4 362.2,101.2 369.09,101.2 R4.2
RESET  (via drill 0.35)
  Top 0.5: U1.13 361.83,119.83 358.01,123.65 352.71,123.65 349.61,120.55 347.4,120.55 344.2,117.35 344.2,112.8 346.36,110.64 BUTTON.4
  Top 1: BUTTON.4 347.14,110.64 344.9,108.4 337.2,108.4 336.31,109.29 R5.2 330.43,112.16 v330.43,120.7
  Bottom 1: v330.43,120.7 334.5,124.77 339.21,124.77 340.77,123.21 J3.3
SCK  (via drill 0.35)
  Top 0.5: J3.6 349.58,123.1 v350.8,124.32 | v355.1,127 366.5,127 369.3,124.2 369.3,122.29 U1.9
  Bottom 0.5: v350.8,124.32 353.48,127 v355.1,127
UCAP
  Top 0.5: U1.6 369.7,119.3 369.7,119.6 370.9,120.8 375.8,120.8 376.9,121.9 376.9,125.2 379.2,127.5 391.6,127.5 395.7,123.4 395.7,119.7 398.6,116.8 416,116.8 C1-1UF2.1
VCC  (via drill 0.35)
  Top 0.35: J2.A4B9 404.75,120.45 v405.2,120 | J2.B4A9 399.85,120.65 v400,120.5
  Top 0.5: U1.7 366.07,116.8 366,116.8 | 363.79,116.8 U1.14 | 366,116.8 363.79,116.8 | U1.44 370.74,112.06 368.85,113.95 | 368.85,113.95 366,116.8 | 362.68,116.8 U1.24 354.83,108.95 352.3,108.95 351.45,109.8 351.45,117.95 v350,119.4 | 362.68,116.8 363.79,116.8 | U1.34 362.68,108.87 362.68,113 | 362.68,113 362.68,116.8 | U1.42 367.59,113 362.68,113 | 368.85,113.95 368.88,113.95 U1.2 371.52,116.59 374.79,116.59 379.21,121.01 379.21,124.3 380.15,125.24 390.66,125.24 392.9,123 v392.9,122.5 | R5.1 331.54,118.67 331.54,122.8 330.51,123.83 313.98,123.83 311.26,121.12 309.28,121.12 v309.2,121.2 | v298.5,121.2 297.53,120.23 MULTIPLEXOR.24 | C1-0.1UF4.1 C1-0.1UF3.1 C1-0.1UF2.1 420.9,115 420.9,121.4 419.2,123.1 C1-1UF1.1 417.7,126.6 412.1,126.6 v410.5,125
  Bottom 0.5: v392.9,122.5 394.8,120.6 v396.9,120.6 399.9,120.6 v400,120.5 404.7,120.5 v405.2,120 407.3,120 410.5,123.2 v410.5,125 | v350,119.4 348.95,119.4 347.37,120.98 340.61,120.98 J3.2 338.49,122.1 R5.1 | v309.2,121.2 v298.5,121.2
XTAL1  (via drill 0.35)
  Top 0.5: U1.17 358.4,118.8 358.4,118.85 357.59,118.85 356.55,119.89 356.55,122.45 v356.5,122.5 | v373.7,127.9 374.7,126.9 v374.7,125.2 | C1-22PF2.1 389.8,118.4 v389.1,118.4 | v386.5,118.4 382.96,121.94 Y1.2
  Bottom 0.5: v356.5,122.5 357.45,123.45 357.45,124.61 360.69,127.86 373.66,127.86 v373.7,127.9 | v374.7,125.2 374.7,124.1 375.9,122.9 Y1.2 | v389.1,118.4 v386.5,118.4
XTAL2  (via drill 0.35)
  Top 0.5: U1.16 358.73,119.6 357.9,119.6 357.3,120.2 357.3,121.3 357.9,121.9 v358.2,121.9 | C1-22PF1.1 387.84,114.66 Y1.1
  Bottom 0.5: v358.2,121.9 358.2,124.3 360.9,127 383.74,127 Y1.1

## Text on the board
tPlace: CARLOS LOPEZ MARTINEZ | GND | VCC | RESET | MOSI | MISO | SCK